# Altium schematic sheet beagle_bone_headers.SchDoc
size A4
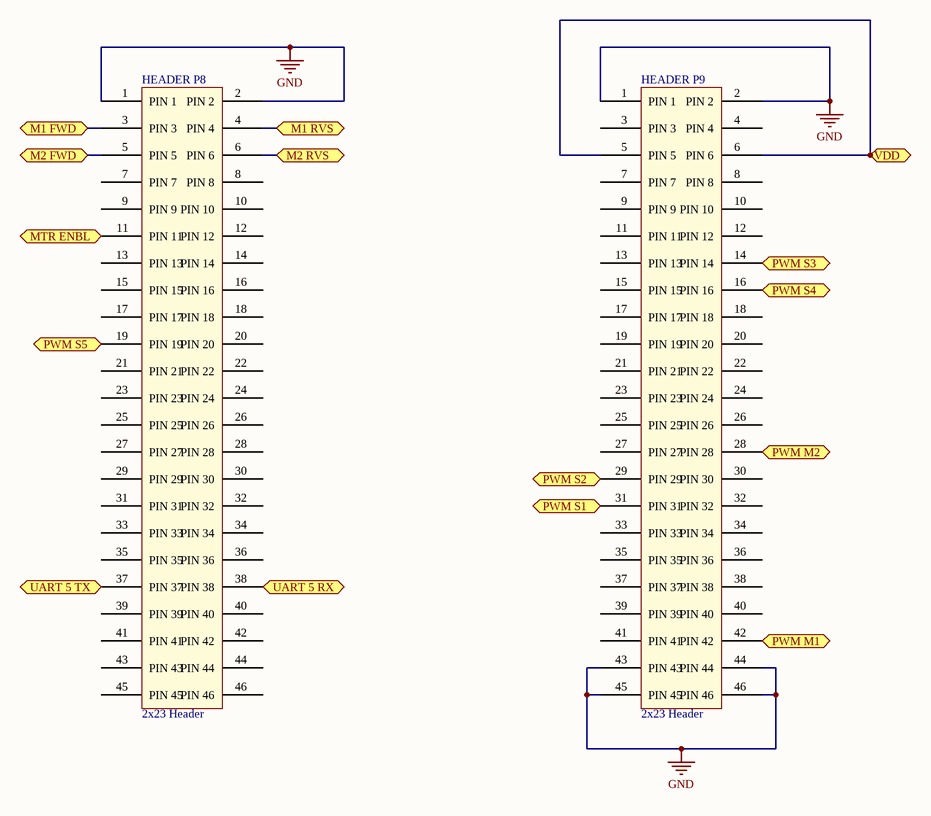
[diagram p0: beagle_bone_headers.SchDoc]

## Parts
HEADER_P8  2x23 Header  [2x23 Header]
HEADER_P9  2x23 Header  [2x23 Header]

## Ports
M1 FWD, M1 RVS, M2 FWD, M2 RVS, MTR ENBL, PWM M1, PWM M2, PWM S1, PWM S2, PWM S3, PWM S4, PWM S5, UART 5 RX, UART 5 TX, VDD

## Nets
GND: HEADER_P8.1(PIN_1) HEADER_P8.2(PIN_2) HEADER_P9.1(PIN_1) HEADER_P9.2(PIN_2) HEADER_P9.43(PIN_43) HEADER_P9.44(PIN_44) HEADER_P9.45(PIN_45) HEADER_P9.46(PIN_46)
M1 FWD: HEADER_P8.3(PIN_3) ; port M1 FWD
M1 RVS: HEADER_P8.4(PIN_4) ; port M1 RVS
M2 FWD: HEADER_P8.5(PIN_5) ; port M2 FWD
M2 RVS: HEADER_P8.6(PIN_6) ; port M2 RVS
MTR ENBL: HEADER_P8.11(PIN_11) ; port MTR ENBL
PWM M1: HEADER_P9.42(PIN_42) ; port PWM M1
PWM M2: HEADER_P9.28(PIN_28) ; port PWM M2
PWM S1: HEADER_P9.31(PIN_31) ; port PWM S1
PWM S2: HEADER_P9.29(PIN_29) ; port PWM S2
PWM S3: HEADER_P9.14(PIN_14) ; port PWM S3
PWM S4: HEADER_P9.16(PIN_16) ; port PWM S4
PWM S5: HEADER_P8.19(PIN_19) ; port PWM S5
UART 5 RX: HEADER_P8.38(PIN_38) ; port UART 5 RX
UART 5 TX: HEADER_P8.37(PIN_37) ; port UART 5 TX
VDD: HEADER_P9.5(PIN_5) HEADER_P9.6(PIN_6) ; port VDD

Not connected (* = marked no-connect by the designer): HEADER_P8 7(PIN_7) 8(PIN_8) 9(PIN_9) 10(PIN_10) 12(PIN_12) 13(PIN_13) 14(PIN_14) 15(PIN_15) 16(PIN_16) 17(PIN_17) 18(PIN_18) 20(PIN_20) 21(PIN_21) 22(PIN_22) 23(PIN_23) 24(PIN_24) 25(PIN_25) 26(PIN_26) 27(PIN_27) 28(PIN_28) 29(PIN_29) 30(PIN_30) 31(PIN_31) 32(PIN_32) 33(PIN_33) 34(PIN_34) 35(PIN_35) 36(PIN_36) 39(PIN_39) 40(PIN_40) 41(PIN_41) 42(PIN_42) 43(PIN_43) 44(PIN_44) 45(PIN_45) 46(PIN_46); HEADER_P9 3(PIN_3) 4(PIN_4) 7(PIN_7) 8(PIN_8) 9(PIN_9) 10(PIN_10) 11(PIN_11) 12(PIN_12) 13(PIN_13) 15(PIN_15) 17(PIN_17) 18(PIN_18) 19(PIN_19) 20(PIN_20) 21(PIN_21) 22(PIN_22) 23(PIN_23) 24(PIN_24) 25(PIN_25) 26(PIN_26) 27(PIN_27) 30(PIN_30) 32(PIN_32) 33(PIN_33) 34(PIN_34) 35(PIN_35) 36(PIN_36) 37(PIN_37) 38(PIN_38) 39(PIN_39) 40(PIN_40) 41(PIN_41)